# Altium schematic sheet battery_protection.SchDoc
size A4
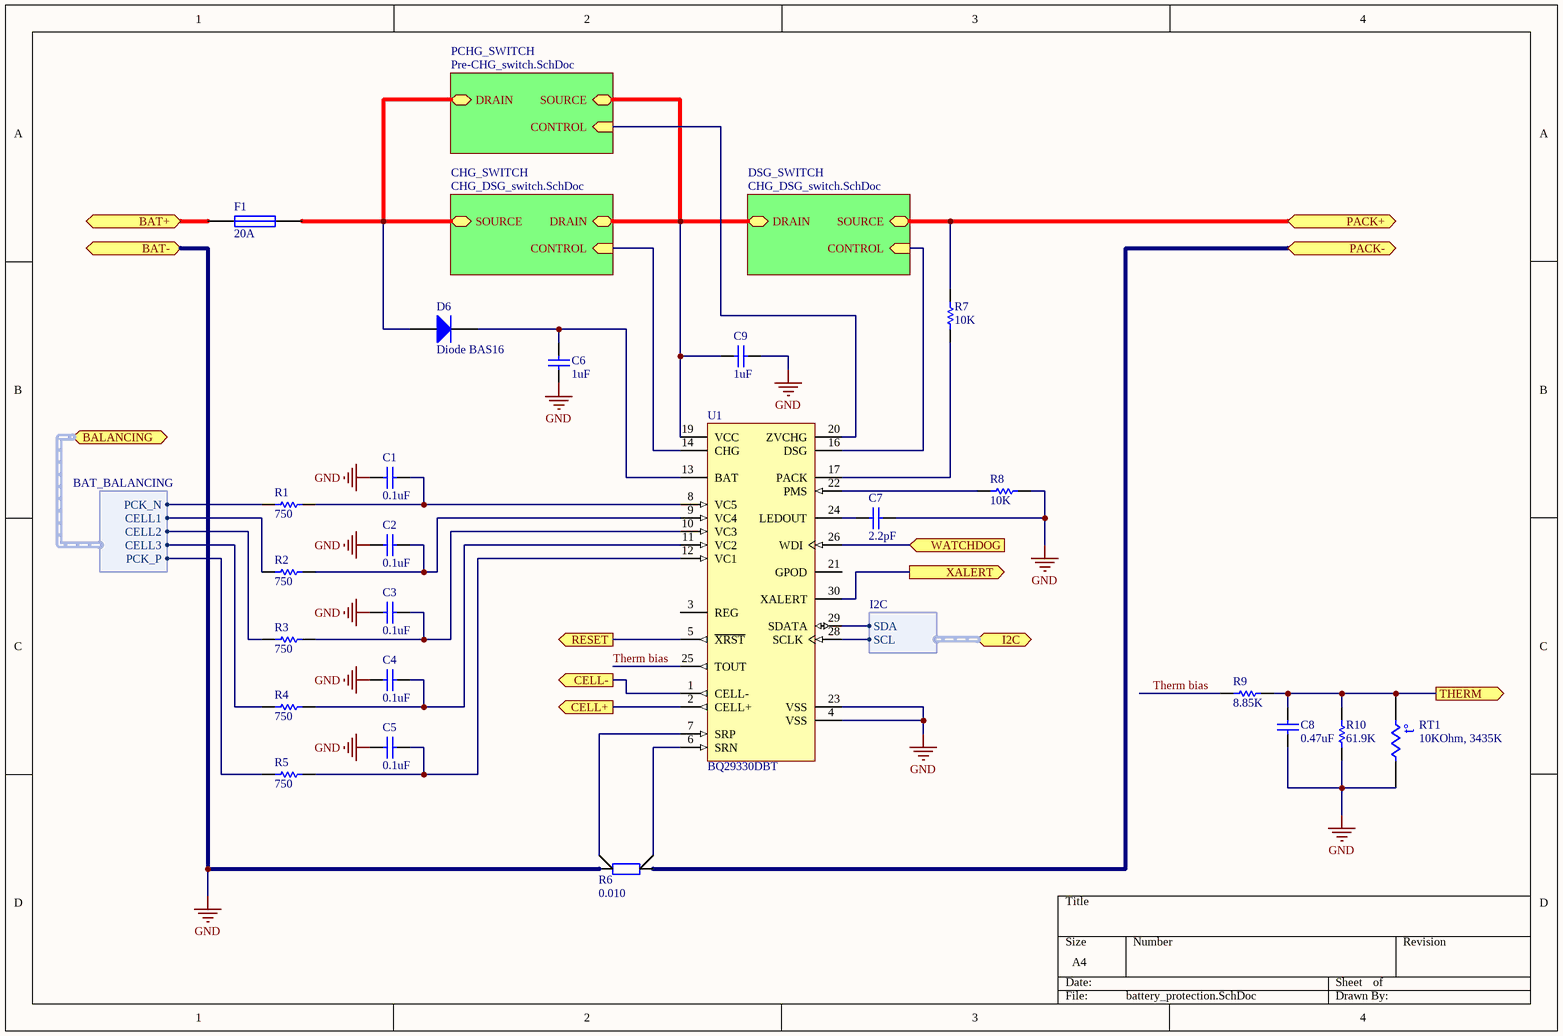
[diagram p0: battery_protection.SchDoc]

## Parts
C1  0.1uF  [RAD-0.3]
C2  0.1uF  [RAD-0.3]
C3  0.1uF  [RAD-0.3]
C4  0.1uF  [RAD-0.3]
C5  0.1uF  [RAD-0.3]
C6  1uF  [RAD-0.3]
C7  2.2pF  [RAD-0.3]
C8  0.47uF  [RAD-0.3]
C9  1uF  [RAD-0.3]
D6  Diode BAS16  [SOT-23_N]
F1  20A  [PIN-W2/E2.8]
R1  750  [AXIAL-0.3]
R2  750  [AXIAL-0.3]
R3  750  [AXIAL-0.3]
R4  750  [AXIAL-0.3]
R5  750  [AXIAL-0.3]
R6  0.010  [2512 package + Kelvin Cons - ERJ1TR Rsns]  (net tie)
R7  10K  [AXIAL-0.3]
R8  10K  [AXIAL-0.3]
R9  8.85K  [AXIAL-0.3]
R10  61.9K  [AXIAL-0.3]
RT1  10KOhm, 3435K  [6-0805_N]
U1  BQ29330DBT  [DBT30_N]

## Sub-sheets
CHG_SWITCH = CHG_DSG_switch.SchDoc: SOURCE, DRAIN, CONTROL (in)
DSG_SWITCH = CHG_DSG_switch.SchDoc: SOURCE, DRAIN, CONTROL (in)
PCHG_SWITCH = Pre-CHG_switch.SchDoc: SOURCE, DRAIN, CONTROL (in)

## Ports
BALANCING (harness BAT_BALANCING), BAT+, BAT-, CELL+ (out), CELL- (out), I2C (harness I2C), PACK+ (bidir), PACK- (bidir), RESET (out), THERM (out), WATCHDOG (in), XALERT (out)

## Harnesses
I2C: SDA, SCL
BAT_BALANCING: PCK_N, CELL1, CELL2, CELL3, PCK_P

## Nets
GND: C1.1 C2.1 C3.1 C4.1 C5.1 C6.1 C7.2 C8.1 C9.1 R8.2 R10.1 RT1.2 U1.4(VSS) U1.23(VSS) ; port BAT-
BAT+: F1.1 ; port BAT+
CELL+: U1.2(CELL+) ; port CELL+
CELL-: U1.1(CELL-) ; port CELL-
PACK+: R7.2 ; port PACK+, sheet DSG_SWITCH/SOURCE
PACK-: R6.2 ; port PACK-
RESET: U1.5(~{XRST}) ; port RESET
THERM: C8.2 R9.2 R10.2 RT1.1 ; port THERM
Therm bias: R9.1 U1.25(TOUT)
WATCHDOG: U1.26(WDI) ; port WATCHDOG
XALERT: U1.30(XALERT) ; port XALERT
NetC1_2: C1.2 R1.1 U1.8(VC5)
NetC2_2: C2.2 R2.1 U1.9(VC4)
NetC3_2: C3.2 R3.1 U1.10(VC3)
NetC4_2: C4.2 R4.1 U1.11(VC2)
NetC5_2: C5.2 R5.1 U1.12(VC1)
NetC6_2: C6.2 D6.3(K) U1.13(BAT)
NetC7_1: C7.1 U1.24(LEDOUT)
NetC9_2: C9.2 U1.19(VCC) ; sheet CHG_SWITCH/DRAIN, sheet DSG_SWITCH/DRAIN, sheet PCHG_SWITCH/SOURCE
NetD6_1: D6.1(A) F1.2 ; sheet CHG_SWITCH/SOURCE, sheet PCHG_SWITCH/DRAIN
NetR1_2: R1.2 ; port BALANCING.PCK_N
NetR2_2: R2.2 ; port BALANCING.CELL1
NetR3_2: R3.2 ; port BALANCING.CELL2
NetR4_2: R4.2 ; port BALANCING.CELL3
NetR5_2: R5.2 ; port BALANCING.PCK_P
NetR6_3: R6.3 U1.7(SRP)
NetR6_4: R6.4 U1.6(SRN)
NetR7_1: R7.1 U1.17(PACK)
NetR8_1: R8.1 U1.22(PMS)
NetU1_14: U1.14(CHG) ; sheet CHG_SWITCH/CONTROL
NetU1_16: U1.16(DSG) ; sheet DSG_SWITCH/CONTROL
NetU1_20: U1.20(ZVCHG) ; sheet PCHG_SWITCH/CONTROL
NetU1_28: U1.28(SCLK) ; port I2C.SCL
NetU1_29: U1.29(SDATA) ; port I2C.SDA

Not connected (* = marked no-connect by the designer): R6 1; U1 3(REG) 15(NC) 18(NC) 21(GPOD) 27(NC)

## Notes on the sheet
- (in symbol Res Thermal) t°

## Library data of the parts
C1-C9 = Cap: Capacitor; Published: 8-Jun-2000; LatestRevisionDate: 17-Jul-2002; LatestRevisionNote: Re-released for DXP Platform.; PackageReference: RAD-0.3; Publisher: Altium Limited; PackageDescription: Radial Cap, Thru-Hole; 2 Leads; 0.3 in Pin Spacing
  C1-C5: Value: 0.1uF
  C6 C9: Value: 1uF
  C7: Value: 2.2pF
  C8: Value: 0.47uF
D6 = Diode BAS16: Silicon Switching Diode for High-Speed Switching; Note: Pin 2 is not connected and not drawn.; Published: 21-Mar-2003; LatestRevisionDate: 29-May-2009; LatestRevisionNote: IPC-7351 Footprint Added.; DatasheetVersion: Oct-1999; PackageVersion: Sep-2001; PackageReference: SOT-23; Publisher: Altium Limited; PackageDescription: 3-Pin SOT-23 Package 0.95 mm Pitch, 2.5 mm Lead Span; ComponentLink1Description: Manufacturer Link; ComponentLink1URL: http://www.infineon.com/; ComponentLink2Description: Datasheet; ComponentLink2URL: http://www.infineon.com/upload/Document/cmc_upload/documents/012/5331/bas16series.pdf
F1 = Fuse 1: Fuse; Published: 8-Jun-2000; LatestRevisionDate: 17-Jul-2002; LatestRevisionNote: Re-released for DXP Platform.; PackageReference: PIN-W2/E2.8; Publisher: Altium Limited; PackageDescription: Thru-Hole; 2 Leads
R1-R5 R7-R10 = Res1: Resistor; Published: 8-Jun-2000; LatestRevisionDate: 17-Jul-2002; LatestRevisionNote: Re-released for DXP Platform.; PackageReference: AXIAL-0.3; Publisher: Altium Limited; PackageDescription: Axial Device, Thru-Hole; 2 Leads; 0.3 in Pin Spacing
  R1-R5: Value: 750
  R7 R8: Value: 10K
  R9: Value: 8.85K
  R10: Value: 61.9K
R6 = Res Kelvin: Resistor Kelvin; Published: 8-Jun-2000; LatestRevisionDate: 17-Jul-2002; LatestRevisionNote: Re-released for DXP Platform.; PackageReference: AXIAL-0.4; Publisher: Altium Limited; Value: 0.010
RT1 = Res Thermal: Thermistor, 10K, 3435K; Published: 24-Mar-1999; LatestRevisionDate: 29-May-2009; LatestRevisionNote: IPC-7351 Footprint Added.; PackageVersion: Mar-2003; PackageReference: 6-0805; Publisher: Altium Limited; PackageDescription: Chip Resistor 0805 Case Size; Code_IPC: RESC2012
U1 = BQ29330DBT: Two, Three and Four Cell Lithium or Lithium-Polymer Battery Protection AFE, -40 to 110 degC, 30-pin TSSOP (DBT), Green (RoHS & no Sb/Br); Manufacturer: Texas Instruments; Lead Acid: N; Li-Ion: Y; SubFamily: Lithium Ion Protection; DatasheetVersion: SLUS673E; PackageVersion: 38596; PackageReference: DBT30; PackageDescription: 30-Pin Thin Shrink Small Outline Package 0.5 mm Pitch; Supplier 1: Digi-Key; Supplier Part Number 1: 296-18607-5-ND; Supplier 2: Farnell; Supplier Part Number 2: 2125387; Supplier 3: Newark; Supplier Part Number 3: 58K5583; Supplier 4: Mouser; Supplier Part Number 4: 595-BQ29330DBT; Eco-Plan: Green (RoHS & no Sb/Br); Li-Polymer: Y; NiCd: N; NiMH: N; Over Voltage Protection: Y; Mounting Technology: Surface Mount; PartNumber: BQ29330DBT; Code_JEDEC: MO-153; ComponentLink1Description: Datasheet; ComponentLink1URL: http://www.ti.com/general/docs/lit/getliterature.tsp?genericPartNumber=BQ29330&fileType=pdf